# EAGLE design touch (EAGLE 7.6.0)
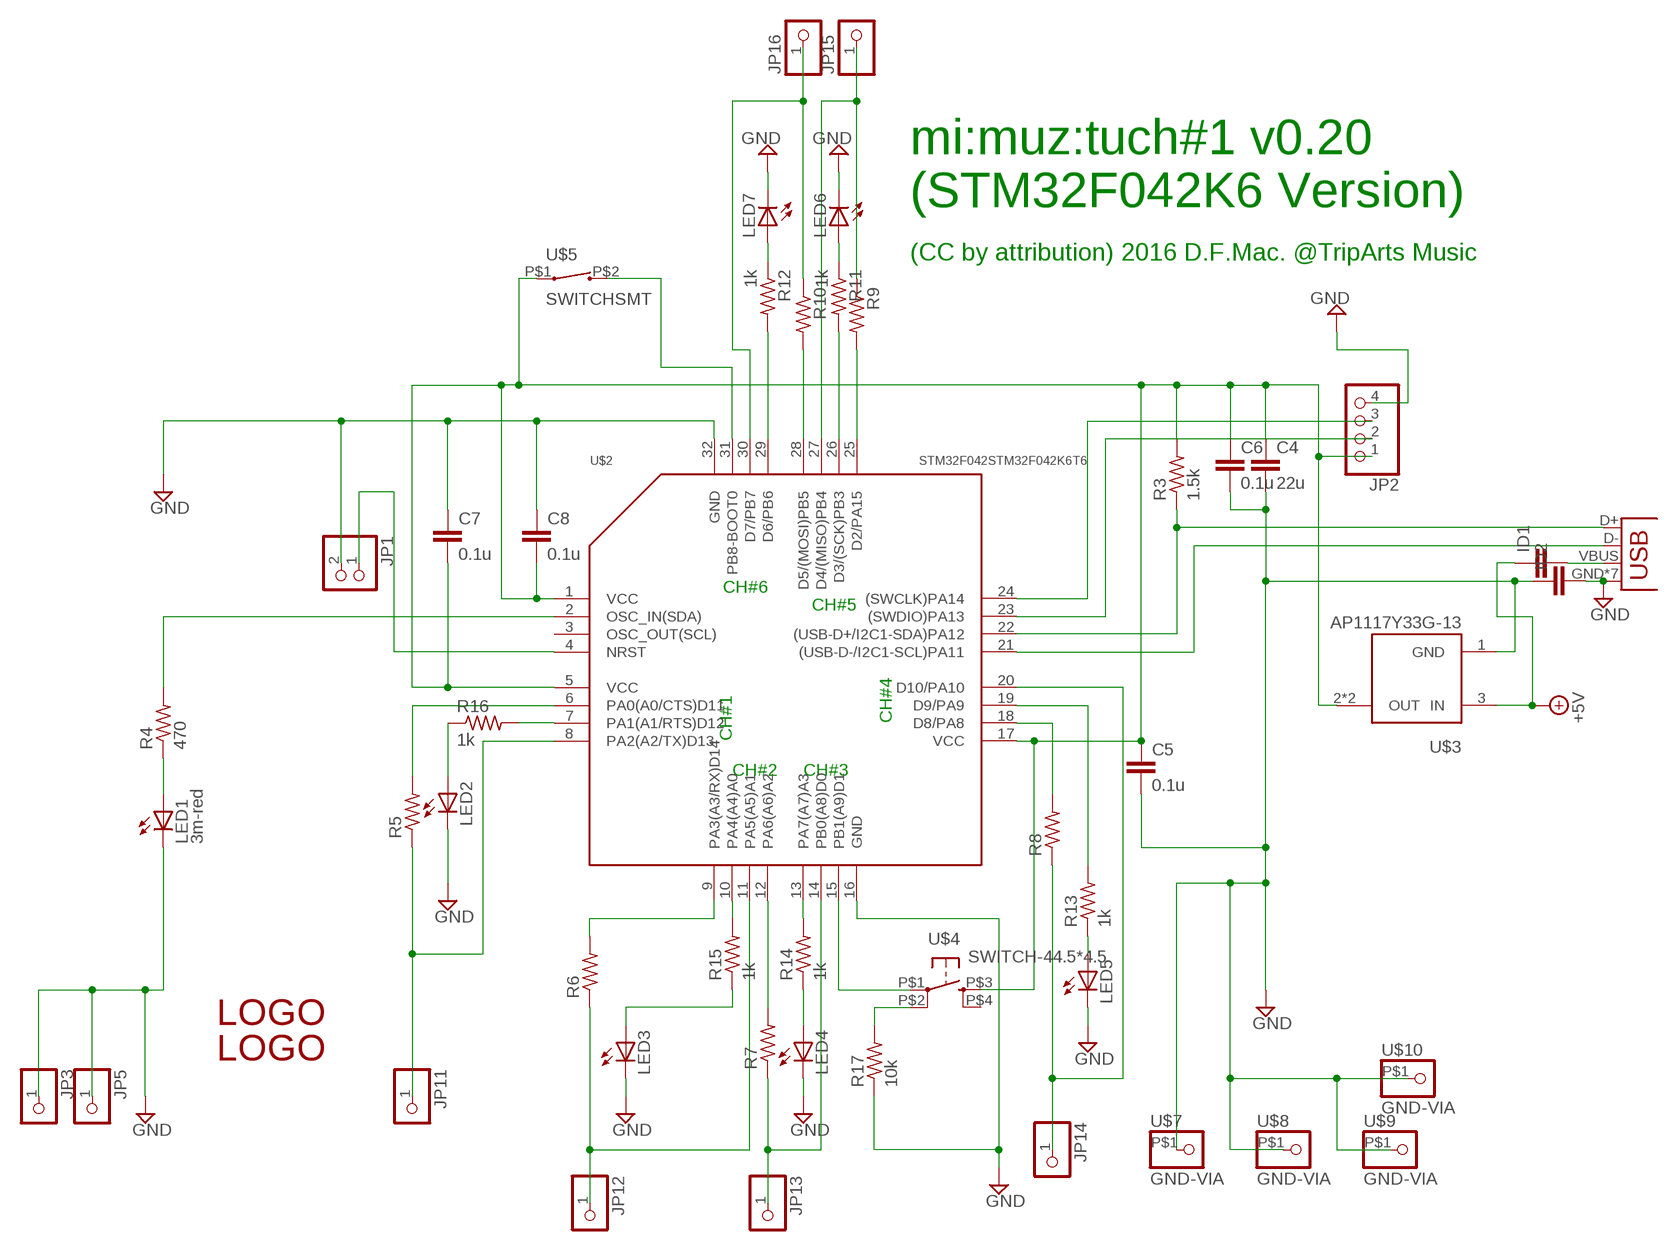
[diagram p0: schematic, sheet 1]

## Parts
C4  22u  C-EUC0805  [C0805]
C5  0.1u  C-EUC0603  [C0603]
C6  0.1u  C-EUC0603  [C0603]
C7  0.1u  C-EUC0603  [C0603]
C8  0.1u  C-EUC0603  [C0603]
ID1  C-EUC0805  [C0805]
ID2  C-EUC0805  [C0805]
JP1  PINHD-1X2  [1X02]
JP2  PINHD-1X4  [1X04]
JP3  PINHD-1X13MM  [1X01]
JP4  USB-MICROB  [USB-MICROB]
JP5  PINHD-1X13MM  [1X01]
JP11  PINHD-1X15MM  [1X01-LARGE]
JP12  PINHD-1X15MM  [1X01-LARGE]
JP13  PINHD-1X15MM  [1X01-LARGE]
JP14  PINHD-1X15MM  [1X01-LARGE]
JP15  PINHD-1X15MM  [1X01-LARGE]
JP16  PINHD-1X15MM  [1X01-LARGE]
LED1  3m-red  LED3MM  [LED3MM]
LED2  LED3MM  [LED3MM]
LED3  LED3MM  [LED3MM]
LED4  LED3MM  [LED3MM]
LED5  LED3MM  [LED3MM]
LED6  LED3MM  [LED3MM]
LED7  LED3MM  [LED3MM]
R3  1.5k  R-US_R0603  [R0603]
R4  470  R-US_R0603  [R0603]
R5  R-US_R0805  [R0805]
R6  R-US_R0805  [R0805]
R7  R-US_R0805  [R0805]
R8  R-US_R0805  [R0805]
R9  R-US_R0805  [R0805]
R10  R-US_R0805  [R0805]
R11  1k  R-US_R0603  [R0603]
R12  1k  R-US_R0603  [R0603]
R13  1k  R-US_R0603  [R0603]
R14  1k  R-US_R0603  [R0603]
R15  1k  R-US_R0603  [R0603]
R16  1k  R-US_R0603  [R0603]
R17  10k  R-US_R0603  [R0603]
U$1  LOGOSMALL  [LOGO-SMALL]
U$2  STM32F042STM32F042K6T6  [TQFP32]
U$3  AP1117Y33G-13  [SOT89]
U$4  SWITCH-44.5*4.5  [SWITCH-SMT-4.5*4.5]
U$5  SWITCHSMT  [SWITCH-SMT-2*4*3]
U$6  LOGOSMALL  [LOGO-SMALL]
U$7  GND-VIA  [GND-VIA]
U$8  GND-VIA  [GND-VIA]
U$9  GND-VIA  [GND-VIA]
U$10  GND-VIA  [GND-VIA]

## Nets
+5V: ID1.1 U$3.3(IN)
D+: JP4.D+ R3.1 U$2.22((USB-D+/I2C1-SDA)PA12)
D-: JP4.D- U$2.21((USB-D-/I2C1-SCL)PA11)
GND [power]: C4.2 C5.2 C6.2 C7.1 C8.1 ID2.1 ID2.2 JP1.2 JP2.4 JP3.1 JP4.GND JP4.MT1(GND) JP4.MT3(GND) JP4.P$2(GND) JP4.P$4(GND) JP4.P$5(GND) JP4.P$6(GND) JP5.1 LED1.K(C) LED2.K(C) LED3.K(C) LED4.K(C) LED5.K(C) LED6.K(C) LED7.K(C) R17.1 U$2.16(GND) U$2.32(GND) U$3.1(GND) U$7.P$1 U$8.P$1 U$9.P$1 U$10.P$1
N$1: R5.2 U$2.6(PA0(A0/CTS)D11)
N$3: R4.2 U$2.2(OSC_IN(SDA))
N$4: R15.2 U$2.10(PA4(A4)A0)
N$5: R16.2 U$2.7(PA1(A1/RTS)D12)
N$7: LED3.A R15.1
N$8: LED1.A R4.1
N$9: R14.2 U$2.13(PA7(A7)A3)
N$10: R17.2 U$4.P$2(P1)
N$11: JP11.1 R5.1 U$2.8(PA2(A2/TX)D13)
N$12: R6.2 U$2.9(PA3(A3/RX)D14)
N$13: R8.2 U$2.18(D8/PA8)
N$14: R13.2 U$2.19(D9/PA9)
N$15: R7.2 U$2.12(PA6(A6)A2)
N$16: R9.2 U$2.25(D2/PA15)
N$17: C4.1 C5.1 C6.1 C7.2 C8.2 JP2.1 R3.2 U$2.1(VCC) U$2.5(VCC) U$2.17(VCC) U$3.2(OUT) U$3.2@1(OUT) U$4.P$3(S) U$5.P$1
N$18: R11.2 U$2.26(D3/(SCK)PB3)
N$19: R10.2 U$2.28(D5/(MOSI)PB5)
N$20: R12.2 U$2.29(D6/PB6)
N$21: U$2.15(PB1(A9)D1) U$4.P$1(P)
N$22: LED2.A R16.1
N$23: LED7.A R12.1
N$24: LED6.A R11.1
N$25: LED4.A R14.1
N$26: LED5.A R13.1
N$27: JP2.3 U$2.24((SWCLK)PA14)
N$28: JP2.2 U$2.23((SWDIO)PA13)
N$29: JP1.1 U$2.4(NRST)
N$30: U$2.31(PB8-BOOT0) U$5.P$2
N$31: JP12.1 R6.1 U$2.11(PA5(A5)A1)
N$32: JP13.1 R7.1 U$2.14(PB0(A8)D0)
N$33: JP14.1 R8.1 U$2.20(D10/PA10)
N$34: JP15.1 R9.1 U$2.27(D4/(MISO)PB4)
N$35: JP16.1 R10.1 U$2.30(D7/PB7)
VBUS: ID1.2 JP4.VBUS
Unconnected: U$2.3(OSC_OUT(SCL)) U$4.P$4(S1)

## Notes on the sheet
- mi:muz:tuch#1 v0.20 
  (STM32F042K6 Version)
- (CC by attribution) 2016 D.F.Mac. @TripArts Music
- CH#6
- CH#5
- CH#4
- CH#1
- CH#2 | CH#3

## Library data of the parts
C4-C8 ID1 ID2 = 0my:C-EU: CAPACITOR, European symbol
JP1 = 0my:PINHD-1X2: PIN HEADER
JP2 = 0my:PINHD-1X4: PIN HEADER
JP3 JP5 JP11-JP16 = 0my:PINHD-1X1: PIN HEADER
JP4 = 0my:USB: USB Connectors USB-B-PTH is fully proven SKU : PRT-00139/CONN-08278 USB-miniB is fully proven SKU : PRT-00587 USB-A-PCB is untested. USB-A-H is throughly reviewed, but untested. Spark Fun Electronics SKU : PRT-00437 USB-B-SMT is throughly reviewed, but untested. Needs silkscreen touching up. USB-A-S has not been used/tested USB-MB-H has not been used/tested USB-MICROB has been used. CONN-09505; PROD_ID: CONN-09505
LED1-LED7 = led:LED: LED OSRAM: - CHIPLED LG R971, LG N971, LY N971, LG Q971, LY Q971, LO R971, LY R971 LH N974, LH R974 LS Q976, LO Q976, LY Q976 LO Q996 - Hyper CHIPLED LW Q18S LB Q993, LB Q99A, LB R99A - SideLED LS A670, LO A670, LY A670, LG A670, LP A670 LB A673, LV A673, LT A673, LW A673 LH A674 LY A675 LS A676, LA A676, LO A676, LY A676, LW A676 LS A679, LY A679, LG A679 - Hyper Micro SIDELED® LS Y876, LA Y876, LO Y876, LY Y876 LT Y87S - SmartLED LW L88C, LW L88S LB L89C, LB L89S, LG L890 LS L89K, LO L89K, LY L89K LS L896, LA L896, LO L896, LY L896 - TOPLED LS T670, LO T670, LY T670, LG T670, LP T670 LSG T670, LSP T670, LSY T670, LOP T670, LYG T670 LG T671, LOG T671, LSG T671 LB T673, LV T673, LT T673, LW T673 LH T674 LS T676, LA T676, LO T676, LY T676, LB T676, LH T676, LSB T676, LW T676 LB T67C, LV T67C, LT T67C, LS T67K, LO T67K, LY T67K, LW E67C LS E67B, LA E67B, LO E67B, LY E67B, LB E67C, LV E67C, LT E67C LW T67C LS T679, LY T679, LG T679 LS T770, LO T770, LY T770, LG T770, LP T770 LB T773, LV T773, LT T773, LW T773 LH T774 LS E675, LA E675, LY E675, LS T675 LS T776, LA T776, LO T776, LY T776, LB T776 LHGB T686 LT T68C, LB T68C - Hyper Mini TOPLED® LB M676 - Mini TOPLED Santana® LG M470 LS M47K, LO M47K, LY M47K Source: http://www.osram.convergy.de LUXEON: - LUMILED® LXK2-PW12-R00, LXK2-PW12-S00, LXK2-PW14-U00, LXK2-PW14-V00 LXK2-PM12-R00, LXK2-PM12-S00, LXK2-PM14-U00 LXK2-PE12-Q00, LXK2-PE12-R00, LXK2-PE12-S00, LXK2-PE14-T00, LXK2-PE14-U00 LXK2-PB12-K00, LXK2-PB12-L00, LXK2-PB12-M00, LXK2-PB14-N00, LXK2-PB14-P00, LXK2-PB14-Q00 LXK2-PR12-L00, LXK2-PR12-M00, LXK2-PR14-Q00, LXK2-PR14-R00 LXK2-PD12-Q00, LXK2-PD12-R00, LXK2-PD12-S00 LXK2-PH12-R00, LXK2-PH12-S00 LXK2-PL12-P00, LXK2-PL12-Q00, LXK2-PL12-R00 Source: www.luxeon.com KINGBRIGHT: KA-3528ASYC Source: www.kingbright.com
R3-R17 = 0my:R-US_: RESISTOR, American symbol
U$1 U$6 = 0my:LOGO
U$2 = 1my:STM32F042
U$3 = AP1117Y33G-13:AP1117Y33G-13
U$4 = 1my:SWITCH-4
U$5 = 1my:SWITCH
U$7-U$10 = 1my:GND-VIA

## Net classes
0 default: width 0.406 mm, clearance 0.254 mm
1 power: width 0.533 mm, clearance 0.254 mm
2 D+: width 0.305 mm, clearance 0.203 mm
3 D-: width 0.305 mm, clearance 0.203 mm
4 VBUS: width 0.406 mm, clearance 0.203 mm

## Board
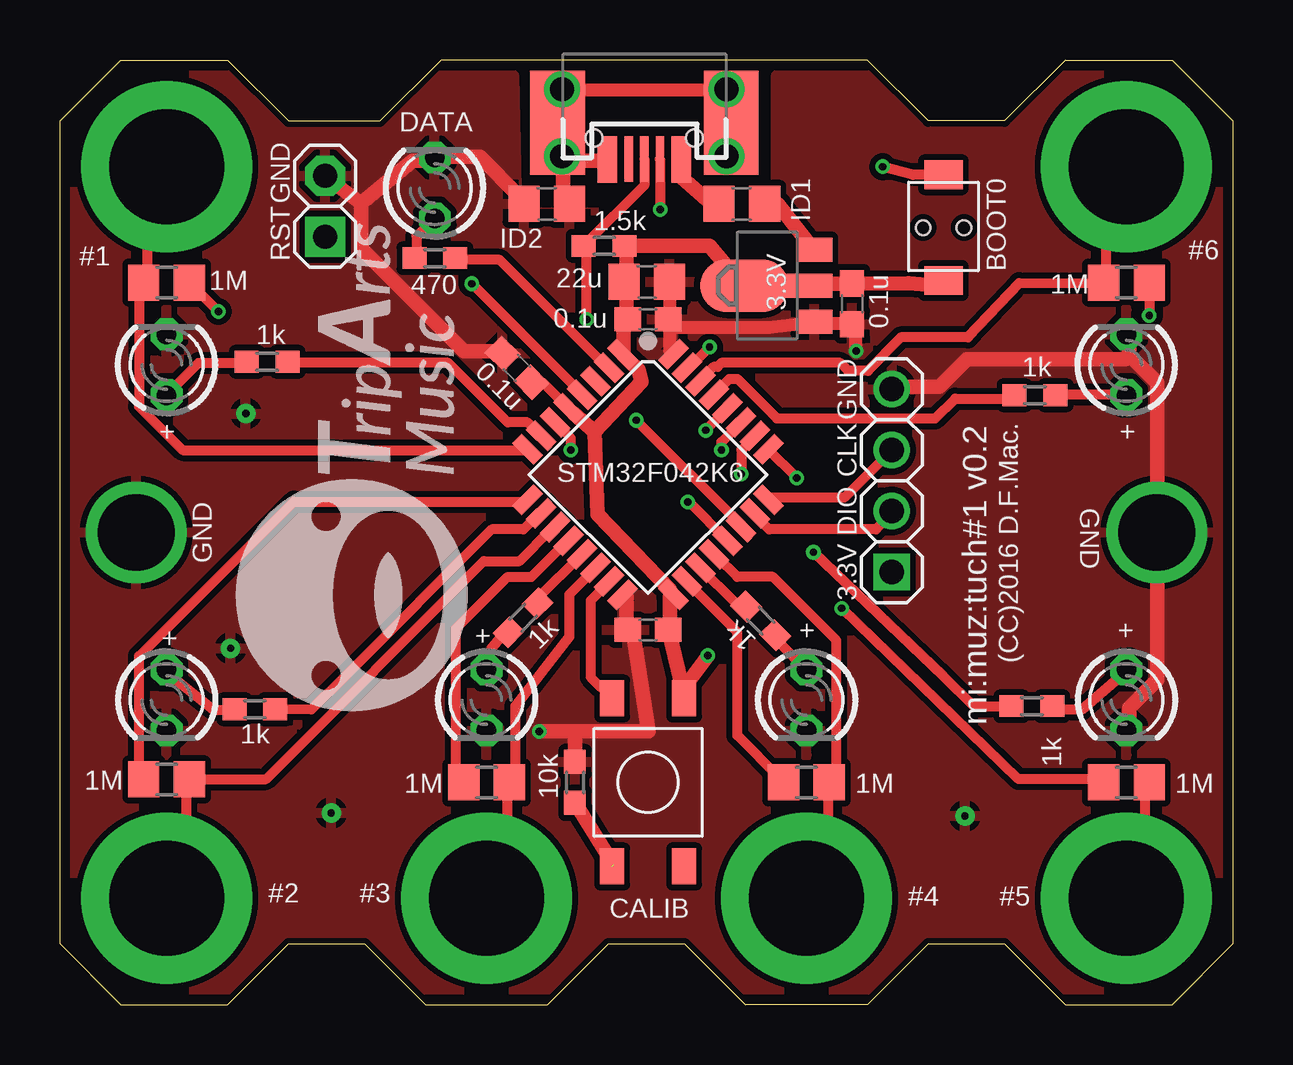
[diagram p1: board, top side]
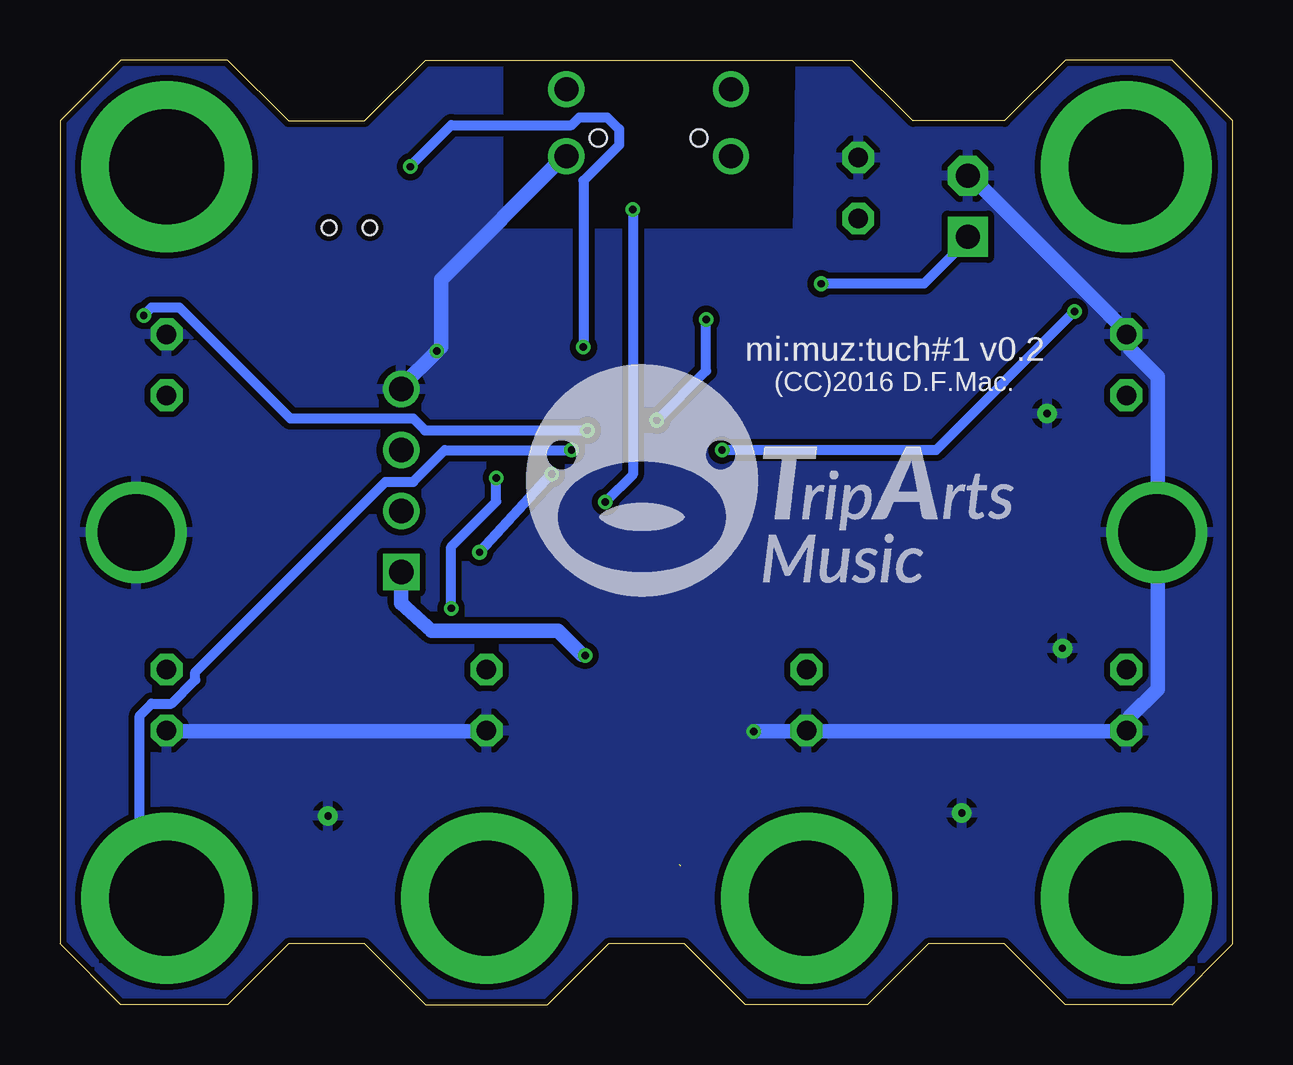
[diagram p2: board, bottom side, seen from below]

Size 48.9 x 39.37 mm. Coordinates in mm from the lower left corner, seen from the top.
Outline: 41.91,0 46.35,0 48.9,2.54 48.9,36.83 46.35,39.37 41.91,39.37 39.37,36.83 36.2,36.83 33.66,39.37 15.88,39.37 13.34,36.83 9.53,36.83 6.99,39.37 2.54,39.37 0,36.83 0,2.54 2.54,0 6.99,0 9.53,2.54 12.7,2.54 15.24,0 20.32,0 22.86,2.54 26.04,2.54 28.57,0 33.66,0 36.2,2.54 39.37,2.54 41.91,0
Copper layers (1*16): Top 0.035mm / dielectric 1.5mm / Bottom 0.035mm
Design rules "Elecrow_2-layer_eagle_rule": minimum track width 6mil, minimum drill 12mil, track to track 6mil, track to pad 6mil, pad to pad 6mil, via to via 6mil, smd to smd 0mil, copper to edge 10mil, drill to drill 10mil, minimum pad ring 10mil, minimum via ring 6mil, stop-mask expansion 2mil, vias tented up to drill 100mil, thermal gap 10mil

### Footprints (pad centres in the part's own frame; a part is rotated, then mirrored left to right if it is on the bottom)
C0805 = smd 1.3 x 1.5: 1 -0.95,0; 2 0.95,0
C0603 = smd 1.1 x 1: 1 -0.85,0; 2 0.85,0
1X02 = drill 1 pad 1.676 square: 1 -1.27,0 | drill 1 pad 1.676 octagon: 2 1.27,0
1X04 = drill 1.016 square: 1 -3.81,0 | drill 1.016: 2 -1.27,0; 3 1.27,0; 4 3.81,0
1X01 = drill 3.2 pad 3.81: 1 0,0
USB-MICROB = smd 0.35 x 1.9: D+ 0,2.904; D- -0.65,2.904; ID 0.65,2.904 | smd 0.813 x 1.93: GND 1.541,2.929; VBUS -1.541,2.929 | smd 2.286 x 4.318: MT1 3.62,1.397; MT3 -3.619,1.397 | drill 1: P$2 -3.429,2.794; P$4 -3.429,0; P$5 3.429,2.794; P$6 3.429,0 | hole 0.7: -2.095,2.032; 2.095,2.032
1X01-LARGE = drill 4.8 pad 7.112: 1 0,0
LED3MM = drill 0.813 octagon: A -1.27,0; K 1.27,0
R0603 = smd 1 x 0.9: 1 -0.85,0; 2 0.85,0
R0805 = smd 1.3 x 1.5: 1 -0.95,0; 2 0.95,0
TQFP32 = smd 1.27 x 0.559: 1 -4.293,2.8; 2 -4.293,2; 3 -4.293,1.2; 4 -4.293,0.4; 5 -4.293,-0.4; 6 -4.293,-1.2; 7 -4.293,-2; 8 -4.293,-2.8; 17 4.293,-2.8; 18 4.293,-2; 19 4.293,-1.2; 20 4.293,-0.4; 21 4.293,0.4; 22 4.293,1.2; 23 4.293,2; 24 4.293,2.8 | smd 0.559 x 1.27: 9 -2.8,-4.293; 10 -2,-4.293; 11 -1.2,-4.293; 12 -0.4,-4.293; 13 0.4,-4.293; 14 1.2,-4.293; 15 2,-4.293; 16 2.8,-4.293; 25 2.8,4.293; 26 2,4.293; 27 1.2,4.293; 28 0.4,4.293; 29 -0.4,4.293; 30 -1.2,4.293; 31 -2,4.293; 32 -2.8,4.293
SOT89 = smd 1 x 1.5: 1 -1.499,-1.981; 3 1.499,-1.981 | smd 1 x 2: 2 0,-1.727 | smd 2.2 x 3.7: 2@1 0,0.94
SWITCH-SMT-4.5*4.5 = smd 1 x 1.5: P$1 -1.5,3.5; P$2 -1.5,-3.5; P$3 1.5,3.5; P$4 1.5,-3.5
SWITCH-SMT-2*4*3 = smd 1.2 x 1.6: P$1 2.2,0; P$2 -2.2,0 | hole 0.6: 0,-0.85; 0,0.85
GND-VIA = drill 0.305 pad 0.508: P$1 0,0

### Placement (x,y rotation side)
C4  24.46,30.12 0 top
C5  33.02,29.21 270 top
C6  19.05,26.54 135 top
C7  24.51,28.57 180 top
C8  24.51,15.62 0 top
ID1  28.42,33.38 180 top
ID2  20.29,33.38 0 top
JP1  11.05,33.27 90 top
JP2  34.67,21.84 90 top
JP3  3.17,19.68 0 top
JP4  24.36,38.15 180 top
JP5  45.72,19.68 0 top
JP11  4.45,34.92 180 top
JP12  4.45,4.45 180 top
JP13  17.78,4.45 180 top
JP14  31.11,4.45 180 top
JP15  44.45,4.45 180 top
JP16  44.45,34.92 180 top
LED1  15.62,34.04 90 top
LED2  4.45,26.67 90 top
LED3  4.45,12.7 270 top
LED4  17.78,12.7 270 top
LED5  31.11,12.7 270 top
LED6  44.45,12.7 270 top
LED7  44.45,26.67 90 top
R3  22.68,31.62 0 top
R4  15.62,31.11 0 top
R5  4.45,30.1 0 top
R6  4.45,9.4 180 top
R7  17.78,9.27 180 top
R8  31.11,9.27 180 top
R9  44.45,9.27 180 top
R10  44.45,30.1 0 top
R11  40.51,12.45 180 top
R12  40.64,25.4 180 top
R13  29.21,16 135 top
R14  19.3,16.13 45 top
R15  8.13,12.32 0 top
R16  8.64,26.8 0 top
R17  21.46,9.27 270 top
U$1  16.99,12.24 90 top
U$2  24.51,22.1 315 top
U$3  29.46,29.97 90 top
U$4  24.51,9.27 0 top
U$5  36.83,32.38 270 top
U$6  29.46,17.02 0 bottom
U$7  11.3,8 0 top
U$8  37.72,7.87 0 top
U$9  7.11,14.86 0 top
U$10  7.75,24.64 0 top

### Tracks (layer width: path | path; a pad name or v marks a point on that pad's centre or on a via)
+5V
  Top 0.406: 29.93,33.35 29.23,33.35 ID1.1 | 31.37,31.53 U$3.3
  Top 0.61: 31.37,31.53 29.93,33.35
D+  (via drill 0.3)
  Top 0.406: v21.96,28.56 21.96,31.53 R3.1 24.36,34.15 JP4.D+ | v24.02,24.36 28.4,19.98 U$2.22
  Bottom 0.406: v21.96,28.56 21.96,26.42 v24.02,24.36
D-  (via drill 0.3)
  Top 0.406: JP4.D- v25.01,33.16 v25.02,33.15 | v26.16,20.95 26.22,20.95 U$2.21
  Bottom 0.406: v25.02,33.15 25.02,22.1 v26.16,20.95
GND  (via drill 0.3)
  Top 0.406: 21.46,11.27 21.59,11.39
  Top 0.533: C7.1 25.43,28.56 25.43,27.24 U$2.32 | C4.2 25.43,30.05 25.43,28.73 C7.1 | C7.1 25.59,28.23 29.55,28.23 30.99,28.4 31.2,28.4 U$3.1 31.53,28.4 33.02,28.4 C5.2 33.19,28.23 v33.19,27.24 | 44.58,27.9 LED7.K | 45.73,19.81 JP5.1 45.73,19.48 | 34.67,25.76 JP2.4 | 44.41,26.91 44.58,27.08 | 44.58,11.56 LED6.K | 18.33,27.24 C6.2 | 11.06,34.51 JP1.2 | 15.52,35.17 LED1.K 15.85,35.33 | JP4.P$2 27.9,35.5 27.9,36.65 JP4.MT3 27.9,36.98 27.9,38.14 JP4.P$4 27.57,38.14 21.13,38.14 JP4.P$6 20.8,38.14 20.8,36.98 JP4.MT1 | 19.48,33.52 ID2.1 19.15,33.68 | 21.13,33.52 ID2.2 20.97,33.68 | 21.13,35.17 20.97,35.33 JP4.MT1 | 22.78,35.17 JP4.GND | 20.97,35 JP4.MT1 | JP4.P$5 20.97,35.5 JP4.MT1 | 23.9,15.39 C8.1 23.61,15.85 | 23.61,17 U$2.16
  Top 0.61: 44.58,27.9 44.58,27.08 45.73,25.92 45.73,19.81 | 34.67,25.76 36.65,25.76 37.81,26.91 44.41,26.91 | 44.58,11.56 44.58,12.38 45.73,13.54 45.73,19.48 | 18.33,27.24 16.84,27.24 12.55,31.53 12.55,33.4 | 11.06,34.51 12.55,33.4 | 15.52,35.17 14.69,35.17 12.55,33.4 | 21.13,35.17 22.78,35.17 | 20.97,35 20.97,33.68 | 15.85,35.33 17.5,35.33 19.15,33.68 | 23.9,15.39 24.54,11.39 21.59,11.39 v19.98,11.39 | 23.61,15.85 23.61,17 | R17.1 21.46,11.27
  Bottom 0.533: 31.2,11.39 LED5.K | 44.41,11.39 LED6.K | 34.67,25.76 JP2.4 | 4.29,11.56 LED3.K 4.62,11.39 | 3.14,19.65 JP3.1 3.14,19.81 | 4.29,27.9 LED2.K 4.46,28.07 | 17.67,11.39 LED4.K 18,11.39 | 10.9,34.51 JP1.2 | 33.02,27.41 v33.19,27.24 | 27.9,35.33 JP4.P$2
  Bottom 0.61: 44.41,11.39 31.2,11.39 | 34.67,25.76 v33.19,27.24 | 4.29,11.56 4.29,12 3.14,13.16 3.14,19.65 | 4.29,27.9 4.29,27.33 3.14,26.18 3.14,19.81 | 4.62,11.39 17.67,11.39 | 18,11.39 v19.98,11.39 | 4.46,28.07 10.9,34.51 | 33.02,27.41 33.02,30.21 27.9,35.33
  pour Bottom: -0.64,40.01 18.03,40.13 18.16,32.13 30.61,32.13 30.61,40.01 49.53,40.01 49.53,-0.64 -0.64,-0.64
  pour Top: 0.64,38.73 18.92,38.73 19.05,33.02 29.84,33.02 29.84,38.73 48.26,38.73 48.26,0.64 0.64,0.64
N$1  (via drill 0.3)
  Top 0.406: v21.3,23.11 21.3,23.61 U$2.6 | v6.6,28.89 5.45,30.05 R5.2
  Bottom 0.406: v21.3,23.11 12.38,23.11 v6.6,28.89
N$3
  Top 0.406: R4.2 16.51,31.04 18.33,31.04 22.78,26.58 U$2.2
N$4
  Top 0.406: R15.2 10.48,12.31 11.89,13.7 18,19.81 19.32,19.81 19.98,20.47 U$2.10
N$5
  Top 0.406: R16.2 9.58,26.75 16.18,26.75 18.66,24.27 19.48,24.27 19.98,23.77 U$2.7
N$7
  Top 0.406: R15.1 7.39,12.31 6.4,12.31 4.46,13.87 LED3.A
N$8
  Top 0.406: R4.1 14.86,31.2 14.86,32.03 15.52,32.69 LED1.A
N$9
  Top 0.406: R14.2 19.99,17 19.98,17 21.63,18.66 U$2.13
N$10  (1 unrouted)
  Top 0.406: 23.14,5.75 23.06,5.83
  Top 0.61: 23.06,5.83 R17.2
N$11
  Top 0.406: U$2.8 19.48,23.11 5.12,23.11 3.3,24.93 3.3,29.88 3.47,30.05 R5.1 3.63,30.21 3.63,34.18 4.29,34.84 JP11.1
N$12
  Top 0.406: U$2.9 19.48,20.97 9.74,20.97 3.3,14.53 3.3,9.58 3.47,9.41 R6.2
N$13
  Top 0.406: U$2.18 26.25,17.5 28.23,15.52 28.23,11.23 30.05,9.41 R8.2
N$14
  Top 0.406: R13.2 28.42,16.59 28.07,16.84 26.75,18.16 U$2.19
N$15
  Top 0.406: U$2.12 21.13,19.32 19.65,17.83 18.66,17.83 16.51,15.68 16.51,9.58 16.68,9.41 R7.2
N$16  (via drill 0.3)
  Top 0.406: v30.71,21.96 29.55,23.11 U$2.25 | v32.59,16.52 39.95,9.41 43.42,9.41 R9.2
  Bottom 0.406: v30.71,21.96 30.71,20.97 32.59,19.09 v32.59,16.52
N$17  (via drill 0.3)
  Top 0.406: 25.43,15.68 C8.2 | 25.43,17 U$2.17 25.43,17.3 | C6.1 19.81,25.92 20.14,25.92 21.13,24.93 U$2.5 21.3,24.77 21.41,24.65 | 23.48,28.69 C7.2 23.61,28.73 | 23.48,27.24 U$2.1 | 23.61,31.53 R3.2 23.77,31.62 | 23.61,30.21 C4.1 23.61,30.05 | 33.02,30.05 C5.1 33.19,30.05 | 31.2,30.05 U$3.2 31.04,30.05 28.56,30.05 U$3.2@1 28.4,30.05 | 36.96,29.93 36.8,29.92 | 36.8,29.92 36.96,29.97 | U$5.P$1 36.8,30.18 36.8,29.92 | 26.02,12.85 26.02,12.91 U$4.P$3 25.97,13.19 25.97,13.16
  Top 0.61: 25.43,17 25.43,15.68 | 26.02,12.83 26.02,12.85 C8.2 | 23.48,27.24 23.48,28.69 | 23.61,30.21 23.61,31.53 | 23.61,30.05 23.61,28.73 | 22.29,23.89 21.41,24.65 | 22.29,23.89 24.23,25.96 24.11,26.45 23.74,26.82 U$2.1 | 31.2,30.05 33.02,30.05 | 36.96,29.93 35.36,30.06 33.19,30.05 | 23.77,31.62 27.08,31.62 28.4,30.05 | 25.43,17.3 22.42,20.43 22.29,23.89 | v27,14.55 25.97,13.16
  Bottom 0.406: v27,14.55 27.13,14.59
  Bottom 0.61: JP2.1 34.67,16.74 33.4,15.6 28.13,15.6 27.13,14.59
N$18  (via drill 0.3)
  Top 0.406: v31.41,18.86 36.82,13.7 38.1,12.43 R11.2 | v28.4,22.12 28.4,23.11 28.89,23.61 U$2.26
  Bottom 0.406: v28.4,22.12 v31.41,18.86
N$19  (via drill 0.3)
  Top 0.406: v26.91,23.94 27.74,24.77 U$2.28 | v45.4,28.73 45.4,30.05 R10.2
  Bottom 0.406: v26.91,23.94 33.68,23.94 34.18,24.43 39.29,24.43 43.92,29.06 45.07,29.06 v45.4,28.73
N$20
  Top 0.406: R12.2 39.79,25.26 37.31,25.26 36.49,24.43 29.88,24.43 28.23,26.09 27.9,26.09 27.24,25.43 U$2.29
N$21
  Top 0.406: U$2.15 22.78,17.5 22.12,16.84 22.12,13.66 U$4.P$1
N$22
  Top 0.406: R16.1 7.76,26.75 5.78,26.75 4.46,25.43 LED2.A
N$23
  Top 0.406: R12.1 41.6,25.43 44.41,25.43 LED7.A
N$24
  Top 0.406: R11.1 41.44,12.31 42.6,12.31 44.41,13.87 LED6.A
N$25
  Top 0.406: R14.1 18.55,15.4 18.44,15.4 17.96,14.8 LED4.A
N$26
  Top 0.406: R13.1 29.98,15.28 30.05,15.02 31.04,14.03 LED5.A
N$27
  Top 0.406: JP2.3 32.69,21.13 29.55,21.13 U$2.24
N$28
  Top 0.406: U$2.23 28.89,20.47 29.55,19.81 34.01,19.81 34.67,20.47 JP2.2
N$29  (via drill 0.3)
  Top 0.406: v17.17,30.05 21.79,25.43 U$2.4
  Bottom 0.406: v17.17,30.05 12.88,30.05 11.06,31.86 JP1.1
N$30  (via drill 0.3)
  Top 0.406: v27.08,27.41 26.25,26.58 U$2.31 | U$5.P$2 35.56,34.59 v34.29,34.92
  Bottom 0.406: v27.08,27.41 27.08,34.34 25.59,35.83 25.59,36.49 26.09,36.98 27.24,36.98 27.57,36.65 32.59,36.65 34.29,34.97 | 34.29,34.97 34.29,34.95 v34.29,34.92 34.29,34.97
N$31
  Top 0.406: U$2.11 20.47,19.81 19.15,18.49 17.67,18.49 8.59,9.41 5.45,9.41 R6.1 5.28,9.25 5.28,5.28 JP12.1
N$32
  Top 0.406: U$2.14 22.29,18.16 21.23,17.11 21.23,15.33 18.99,12.45 18.99,9.58 18.82,9.41 R7.1 18.66,9.08 18.66,5.28 17.83,4.46 JP13.1
N$33
  Top 0.406: U$2.20 27.41,18.66 28.23,17.83 29.72,17.83 32.36,15.19 32.36,9.58 32.19,9.41 R8.1 32.03,9.08 32.03,5.28 31.2,4.46 JP14.1
N$34  (via drill 0.3)
  Top 0.406: v27.57,23.11 27.57,23.44 U$2.27 | R9.1 45.24,9.25 45.24,5.12 44.58,4.46 JP15.1
  Bottom 0.406: v27.57,23.11 32.85,23.11 34.18,21.79 35.33,21.79 43.26,13.87 43.26,13.54 44.25,12.55 45.07,12.55 45.57,12.05 45.57,5.45 44.58,4.46 JP15.1
N$35
  Top 0.406: U$2.30 26.75,26.09 27.24,26.58 27.41,26.58 27.57,26.75 32.52,26.75 32.85,26.42 33.68,26.42 35.05,27.81 37.85,27.81 39.98,30.07 43.54,30.05 43.42,30.05 R10.1 43.59,30.21 43.59,34.01 44.41,34.84 JP16.1
VBUS
  Top 0.406: 25.92,34.45 25.92,34.78 JP4.VBUS | ID1.2
  Top 0.61: ID1.2 26.96,33.54 25.92,34.45

### Text on the board
_tNames: DATA | GND | ID1 | 1.5k | BOOT0 | RST | ID2 | #1 | #6 | 1M | 470 | 22u | 3.3V | 1M | 0.1u | 0.1u | 1k | 1k | 0.1u | GND | + | + | CLK | STM32F042K6 | DIO | GND | (CC)2016 D.F.Mac. | GND | 3.3V | mi:muz:tuch#1 v0.2 | + | + | + | + | 1k | 1k | 1k | 1k | 10k | 1M | 1M | 1M | 1M | #2 | #3 | #4 | #5 | CALIB
_bNames: mi:muz:tuch#1 v0.2 | (CC)2016 D.F.Mac.